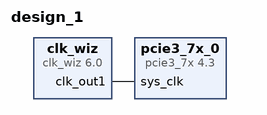
[diagram p0: block diagram of the top level]
# Vivado block design design_1, xc7vh870tflg1932-2, Vivado 2024.2
create_bd_design design_1

create_bd_cell -type ip -vlnv xilinx.com:ip:pcie3_7x:4.3 pcie3_7x_0
create_bd_cell -type ip -vlnv xilinx.com:ip:clk_wiz:6.0 clk_wiz
set_property -dict {CONFIG.CLKOUT1_REQUESTED_OUT_FREQ 100.0} [get_bd_cells clk_wiz]

# ---- connections ----

connect_bd_net [get_bd_pins clk_wiz/clk_out1] [get_bd_pins pcie3_7x_0/sys_clk]

validate_bd_design
save_bd_design
